# Altium schematic sheet MiCore_LCD.SchDoc: MiCore - LCD
size A4; DrawnBy: eleqian; Revision: 1.0; SheetNumber: 3; SheetTotal: 3
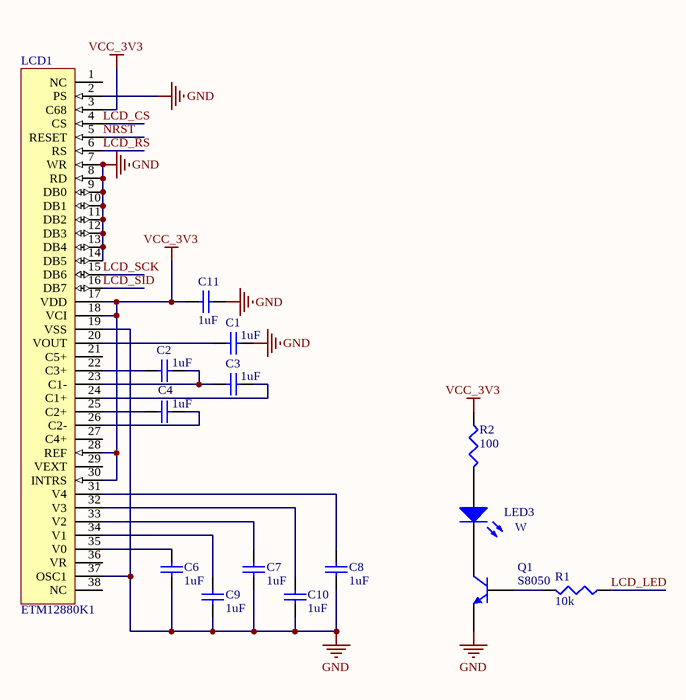
[diagram p0: MiCore_LCD.SchDoc]

## Parts
C1  value 1uF  [0603C]  (hidden comment: Cap)
C2  value 1uF  [0603C]  (hidden comment: Cap)
C3  value 1uF  [0603C]  (hidden comment: Cap)
C4  value 1uF  [0603C]  (hidden comment: Cap)
C6  value 1uF  [0603C]  (hidden comment: Cap)
C7  value 1uF  [0603C]  (hidden comment: Cap)
C8  value 1uF  [0603C]  (hidden comment: Cap)
C9  value 1uF  [0603C]  (hidden comment: Cap)
C10  value 1uF  [0603C]  (hidden comment: Cap)
C11  value 1uF  [0603C]  (hidden comment: Cap)
LCD1  ETM12880K1  [TL0350_38P]
LED3  W  [1206LED]
Q1  S8050  [SOT-23]
R1  value 10k  [0603R]  (hidden comment: Res3)
R2  value 100  [0603R]  (hidden comment: Res3)

## Nets
GND: C1.2 C6.1 C7.1 C8.1 C9.1 C10.1 C11.2 LCD1.2(PS) LCD1.7(WR) LCD1.8(RD) LCD1.9(DB0) LCD1.10(DB1) LCD1.11(DB2) LCD1.12(DB3) LCD1.13(DB4) LCD1.14(DB5) LCD1.19(VSS) LCD1.37(OSC1) Q1.3(E)
VCC_3V3: C11.1 LCD1.3(C68) LCD1.17(VDD) LCD1.18(VCI) LCD1.28(REF) LCD1.30(INTRS) R2.1
LCD_CS: LCD1.4(CS)
LCD_LED: R1.1
LCD_RS: LCD1.6(RS)
LCD_SCK: LCD1.15(DB6)
LCD_SID: LCD1.16(DB7)
NRST: LCD1.5(RESET)
NetC1_1: C1.1 LCD1.20(VOUT)
NetC2_1: C2.1 LCD1.22(C3+)
NetC2_2: C2.2 C3.1 LCD1.23(C1-)
NetC3_2: C3.2 LCD1.24(C1+)
NetC4_1: C4.1 LCD1.26(C2-)
NetC4_2: C4.2 LCD1.25(C2+)
NetC6_2: C6.2 LCD1.35(V0)
NetC7_2: C7.2 LCD1.33(V2)
NetC8_2: C8.2 LCD1.31(V4)
NetC9_2: C9.2 LCD1.34(V1)
NetC10_2: C10.2 LCD1.32(V3)
NetLED3_1: LED3.1(A) R2.2
NetLED3_2: LED3.2(K) Q1.1(C)
NetQ1_2: Q1.2(B) R1.2

Not connected (* = marked no-connect by the designer): LCD1 1(NC) 21(C5+) 27(C4+) 29(VEXT) 36(VR) 38(NC)

## Library data of the parts
C1-C4 C6-C11 = Cap: Capacitor; Published: 8-Jun-2000; LatestRevisionDate: 17-Jul-2002; LatestRevisionNote: Re-released for DXP Platform.; PackageReference: CAPC2012L; Publisher: Altium Limited
LCD1 = ETM12880K: LCD, 主控TL0350
LED3 = LED3: Typical White LED; Published: 8-Jun-2000; LatestRevisionDate: 17-Dec-2003; LatestRevisionNote: PCB Footprint replaced.; DatasheetVersion: 16-Apr-2002; PackageVersion: 16-Apr-2002; PackageReference: 3.5X2.8X1.9; Publisher: Altium Limited
Q1 = NPN: NPN Bipolar Transistor; pin to pad: 1>3 2>1 3>2; Published: 8-Jun-2000; LatestRevisionDate: 17-Jul-2002; LatestRevisionNote: Re-released for DXP Platform.; PackageReference: TO-226-AA; Publisher: Altium Limited; PackageDescription: TO, Flat Index; 3 In-Line, Axial Leads; Body Dia. 4.8mm; Leads 0.55 x 0.51 mm (max); Code_JEDEC: TO-226-AA
R1 R2 = Res3: Resistor; Published: 8-Jun-2000; LatestRevisionDate: 29-May-2009; LatestRevisionNote: IPC-7351 Footprint Added.; PackageReference: J1-0603; Publisher: Altium Limited; PackageDescription: Chip Resistor